# EAGLE design RFM12B-Breakout-v10 (EAGLE 6.4)
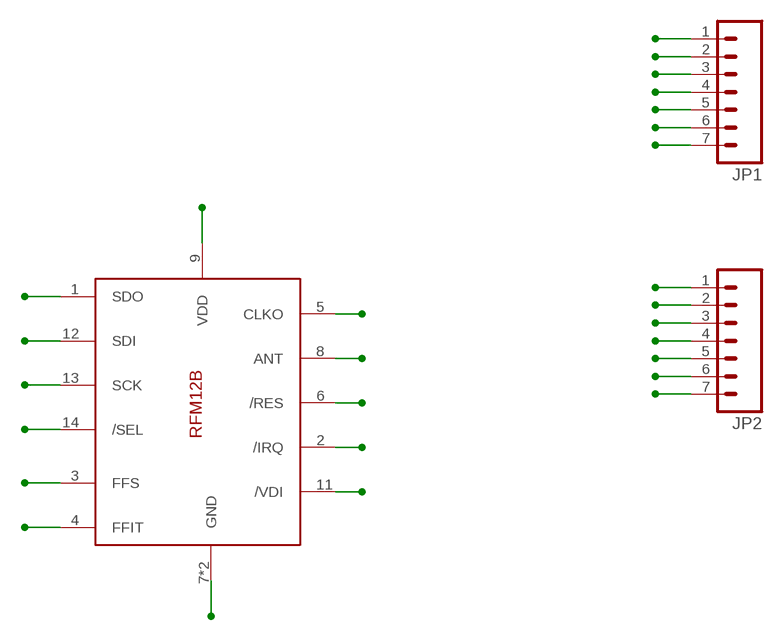
[diagram p0: schematic, sheet 1]

## Parts
JP1  M07LONGPADS  [1X07_LONGPADS]
JP2  M07LONGPADS  [1X07_LONGPADS]
U$1  RFM12B  [RFM12B-MODULE]

## Nets
ANT: JP2.7 U$1.8(ANT)
CLKO: JP1.5 U$1.5(CLKO)
FFIT: JP1.4 U$1.4(FFIT)
FFS: JP1.3 U$1.3(FFS)
GND: JP1.7 JP2.5 U$1.7(GND) U$1.10(GND)
IRQ: JP1.2 U$1.2(/IRQ)
RES: JP1.6 U$1.6(/RES)
SCK: JP2.2 U$1.13(SCK)
SDI: JP2.3 U$1.12(SDI)
SDO: JP1.1 U$1.1(SDO)
SEL: JP2.1 U$1.14(/SEL)
VDD: JP2.6 U$1.9(VDD)
VDI: JP2.4 U$1.11(/VDI)

## Library data of the parts
JP1 JP2 = SparkFun-Connectors:M07: Header 7 Standard 7-pin 0.1" header. Use with straight break away headers (SKU : PRT-00116), right angle break away headers (PRT-00553), swiss pins (PRT-00743), machine pins (PRT-00117), and female headers (PRT-00115). NOTES ON THE VARIANTS LOCK and LOCK_LONGPADS... This footprint was designed to help hold the alignment of a through-hole component (i.e. 7-pin header) while soldering it into place. You may notice that each hole has been shifted either up or down by 0.005 of an inch from it's more standard position (which is usually a perfectly straight line). This slight alteration caused the pins (the squares in the middle) to touch the edges of the holes. Because they are alternating, it causes a "brace" to hold the header in place. 0.005 has proven to be the perfect amount of "off-center" position when using our standard breakaway headers. Although looks a little odd when you look at the bare footprint, once you have a header in there, the alteration is very hard to notice. Also, if you push a header all the way into place, it is covered up entirely on the bottom side. This idea of altering the position of holes to aid alignment will be further integrated into the Sparkfun Library for other footprints. It can help hold any component with 3 or more connection pins.
U$1 = Synapseware:RFM12B: The RFM12B is a great inexpensive option for wireless communication; it's an ISM band FSK transceiver module implemented with a unique PLL. These modules operate in the 434MHZ band and fully comply with FCC and ETSI regulations. This module has a wide voltage supply range of 2.2-3.8VDC. An SPI interface is used to send data and configure the RFM12 module. The configuration commands, described in the RF12 IC Datasheet linked below, can be used to set the data rate, frequency band, wake-up timer, transfer data, receive data from the 16-bit FIFO, and much more.

## Board
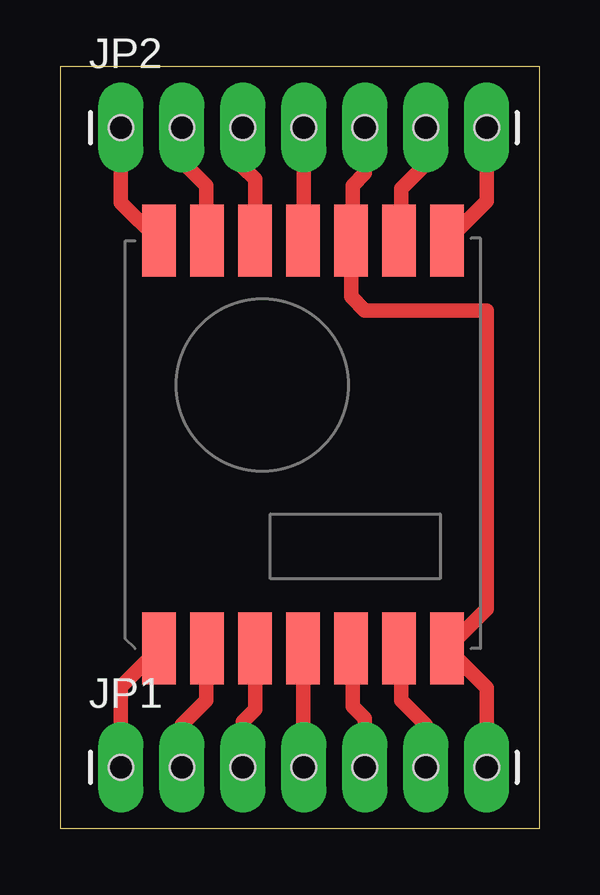
[diagram p1: board, top side]

Size 19.99 x 31.74 mm. Coordinates in mm from the lower left corner, seen from the top.
Outline: 0,0 19.99,0 19.99,31.74 0,31.74 0,0
Copper layers (1*16): Top 0.035mm / dielectric 1.5mm / Bottom 0.035mm
Design rules "default": minimum track width 10mil, minimum drill 0.6mm, track to track 8mil, track to pad 8mil, pad to pad 8mil, via to via 8mil, smd to smd 8mil, copper to edge 40mil, drill to drill 8mil, minimum pad ring 10mil, minimum via ring 8mil, stop-mask expansion 4mil, vias tented up to drill 0mil, thermal gap 10mil

### Footprints (pad centres in the part's own frame; a part is rotated, then mirrored left to right if it is on the bottom)
1X07_LONGPADS = drill 1.016 pad 1.88 long: 1 0,0; 2 2.54,0; 3 5.08,0; 4 7.62,0; 5 10.16,0; 6 12.7,0; 7 15.24,0 | hole 1.016: 0,0; 2.54,0; 5.08,0; 7.62,0; 10.16,0; 12.7,0; 15.24,0
RFM12B-MODULE = smd 2.997 x 1.397: 1 0,12; 2 0,10; 3 0,8; 4 0,6; 5 0,4; 6 0,2; 7 0,0; 8 17,0; 9 17,2; 10 17,4; 11 17,6; 12 17,8; 13 17,10; 14 17,12

### Placement (x,y rotation side)
JP1  2.54,2.54 0 top
JP2  2.54,29.21 0 top
U$1  16.13,7.49 90 top

### Tracks (layer width: path | path; a pad name or v marks a point on that pad's centre or on a via)
ANT
  Top 0.61: JP2.7 17.78,26.14 U$1.8
CLKO
  Top 0.61: JP1.5 12.7,4.57 12.19,5.08 12.19,7.43 U$1.5
FFIT
  Top 0.61: U$1.4 10.13,2.57 JP1.4
FFS
  Top 0.61: JP1.3 7.62,4.45 8.13,4.95 U$1.3
GND
  Top 0.61: JP2.5 12.7,27.3 12.19,26.8 12.19,24.56 U$1.10 12.13,22.16 12.7,21.59 17.78,21.59 17.78,9.14 U$1.7 17.78,5.84 JP1.7
IRQ
  Top 0.61: JP1.2 5.08,4.32 6.1,5.33 6.1,7.46 U$1.2
RES
  Top 0.61: JP1.6 15.24,4.32 14.22,5.33 14.22,7.4 U$1.6
SCK
  Top 0.61: JP2.2 5.08,27.81 6.1,26.8 6.1,24.53 U$1.13
SDI
  Top 0.61: JP2.3 7.62,27.56 8.13,27.05 U$1.12
SDO
  Top 0.61: JP1.1 2.54,5.9 U$1.1
SEL
  Top 0.61: JP2.1 2.54,26.08 U$1.14
VDD
  Top 0.61: JP2.6 15.24,27.69 14.22,26.67 14.22,24.59 U$1.9
VDI
  Top 0.61: JP2.4 10.16,24.52 U$1.11